# EAGLE design pqc-rev1 (EAGLE 6.1)
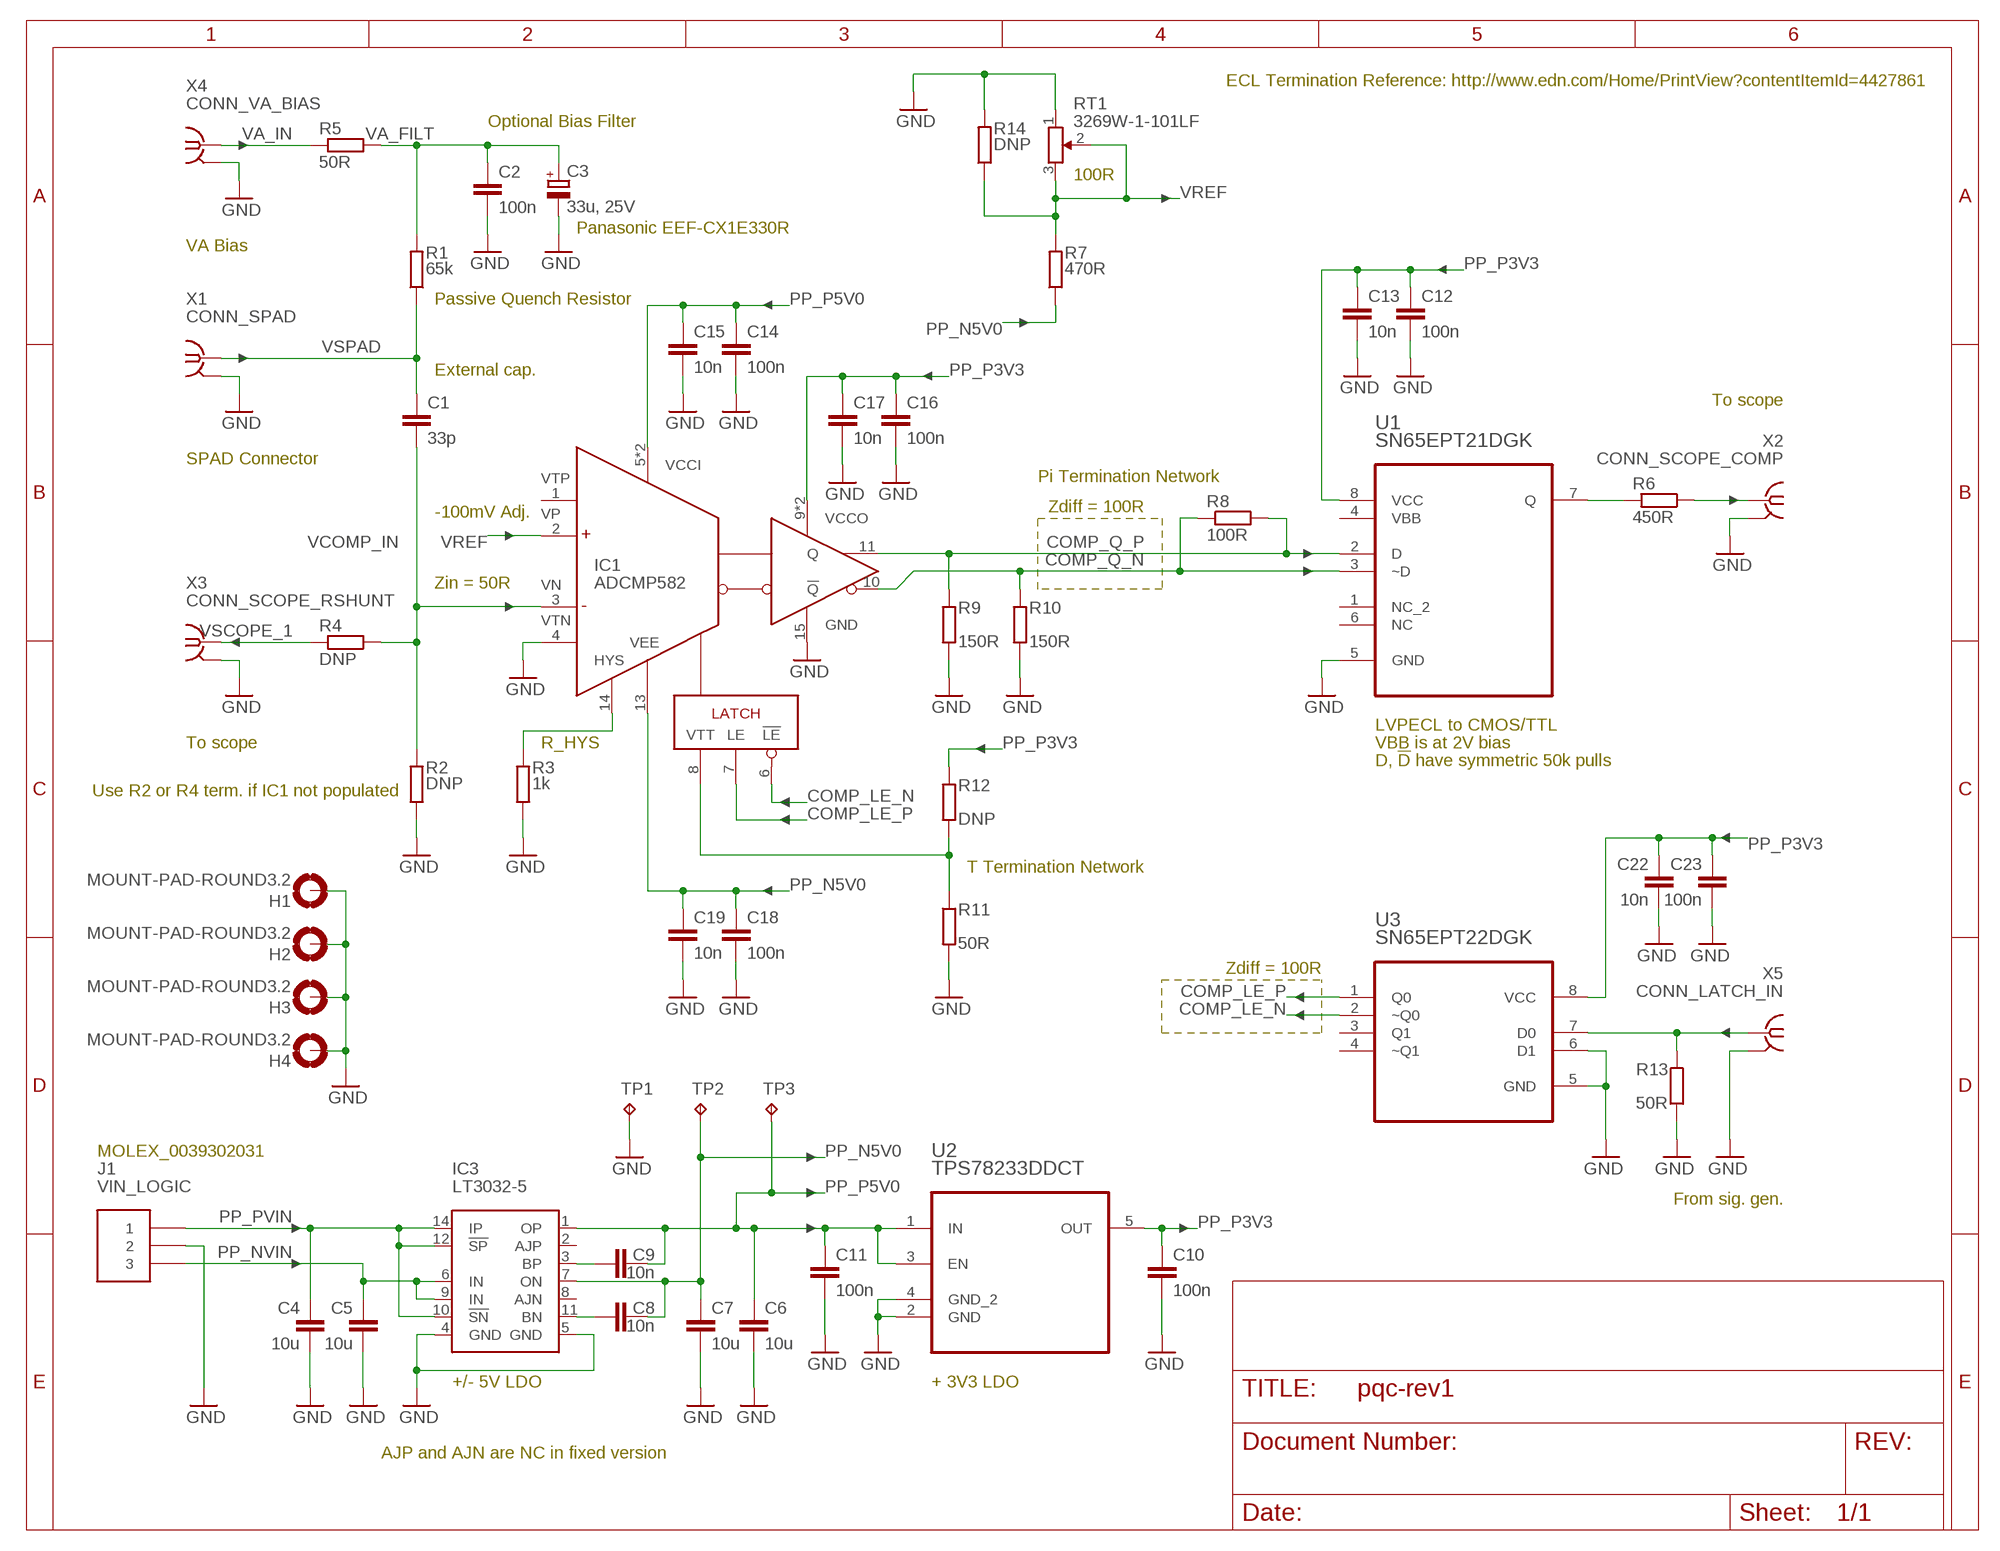
[diagram p0: schematic, sheet 1]

## Parts
C1  33p  C-EUC0805  [C0805]
C2  100n  C-EUC0805  [C0805]
C3  33u, 25V  CPOL-EUCT7343  [CT7343]
C4  10u  C-EUC1206  [C1206]
C5  10u  C-EUC1206  [C1206]
C6  10u  C-EUC1206  [C1206]
C7  10u  C-EUC1206  [C1206]
C8  10n  C-EUC0603  [C0603]
C9  10n  C-EUC0603  [C0603]
C10  100n  C-EUC0603  [C0603]
C11  100n  C-EUC0603  [C0603]
C12  100n  C-EUC0603  [C0603]
C13  10n  C-EUC0603  [C0603]
C14  100n  C-EUC0603  [C0603]
C15  10n  C-EUC0603  [C0603]
C16  100n  C-EUC0603  [C0603]
C17  10n  C-EUC0603  [C0603]
C18  100n  C-EUC0603  [C0603]
C19  10n  C-EUC0603  [C0603]
C22  10n  C-EUC0603  [C0603]
C23  100n  C-EUC0603  [C0603]
H1  MOUNT-PAD-ROUND3.2  [3,2-PAD]
H2  MOUNT-PAD-ROUND3.2  [3,2-PAD]
H3  MOUNT-PAD-ROUND3.2  [3,2-PAD]
H4  MOUNT-PAD-ROUND3.2  [3,2-PAD]
IC1  ADCMP582  [QFN50P300X300X80-16N]
IC3  LT3032-5  LT3032  [DFN14-4X3DE]
J1  VIN_LOGIC  CONN_MOLEX_3PIN_MINI-FIT_JR  [CONN_MOLEX_3PIN_MINI-FIT_JR]
R1  65k  R-EU_R0805  [R0805]
R2  DNP  R-EU_R0603  [R0603]
R3  1k  R-EU_R0805  [R0805]
R4  DNP  R-EU_R0603  [R0603]
R5  50R  R-EU_R0805  [R0805]
R6  450R  R-EU_R0805  [R0805]
R7  470R  R-EU_R0805  [R0805]
R8  100R  R-EU_R0603  [R0603]
R9  150R  R-EU_R0603  [R0603]
R10  150R  R-EU_R0603  [R0603]
R11  50R  R-EU_R0603  [R0603]
R12  DNP  R-EU_R0603  [R0603]
R13  50R  R-EU_R0603  [R0603]
R14  DNP  R-EU_R0805  [R0805]
RT1  3269W-1-101LF  BOURNS_3269WX  [3269W]
TP1  TPTP20R  [TP20R]
TP2  TPTP20R  [TP20R]
TP3  TPTP20R  [TP20R]
U1  SN65EPT21DGK  [SOP65P490X110-8N]
U2  TPS78233DDCT  [SOT95P280X110-5N]
U3  SN65EPT22DGK  [SOP65P490X110-8N]
X1  CONN_SPAD  SMA-142-0711-871/876  [J502-ND-142-0711-871/876]
X2  CONN_SCOPE_COMP  SMA-142-0711-871/876  [J502-ND-142-0711-871/876]
X3  CONN_SCOPE_RSHUNT  SMA-142-0711-871/876  [J502-ND-142-0711-871/876]
X4  CONN_VA_BIAS  SMA-142-0711-871/876  [J502-ND-142-0711-871/876]
X5  CONN_LATCH_IN  SMA-142-0711-871/876  [J502-ND-142-0711-871/876]

## Nets
COMP_LE_N [100OHM_DIFF]: IC1.6(!LE) U3.2(~Q0)
COMP_LE_P [100OHM_DIFF]: IC1.7(LE) U3.1(Q0)
COMP_Q_N [100OHM_DIFF]: IC1.10(!Q) R8.1 R10.1 U1.3(~D)
COMP_Q_P [100OHM_DIFF]: IC1.11(Q) R8.2 R9.1 U1.2(D)
GND: C2.2 C3.- C4.2 C5.2 C6.2 C7.2 C10.2 C11.2 C12.2 C13.2 C14.2 C15.2 C16.2 C17.2 C18.2 C19.2 C22.2 C23.2 H1.B3,2(MOUNT) H2.B3,2(MOUNT) H3.B3,2(MOUNT) H4.B3,2(MOUNT) IC1.4(VTN) IC1.15(GND) IC3.4(GND) IC3.5(GND) J1.2 R2.1 R3.1 R9.2 R10.2 R11.2 R13.2 R14.2 RT1.1 TP1.TP U1.5(GND) U2.2(GND) U2.4(GND_2) U3.5(GND) U3.6(D1) X1.G@1(GND) X2.G@1(GND) X3.G@1(GND) X4.G@1(GND) X5.G@1(GND)
N$1: R6.2 U1.7(Q)
N$2: R6.1 X2.1
N$4: IC1.14(HYS) R3.2
N$6: IC1.8(VTT) R11.1 R12.2
N$8: C9.1 IC3.3(BP)
N$9: C8.1 IC3.11(BN)
N$10: R13.1 U3.7(D0) X5.1
PP_N5V0: C7.1 C8.2 C18.1 C19.1 IC1.13(VEE) IC3.7(ON) R7.1 TP2.TP
PP_NVIN: C5.1 IC3.6(IN) IC3.9(IN) J1.3
PP_P3V3: C10.1 C12.1 C13.1 C16.1 C17.1 C22.1 C23.1 IC1.9(VCCO) IC1.12(VCCO) R12.1 U1.8(VCC) U2.5(OUT) U3.8(VCC)
PP_P5V0: C6.1 C9.2 C11.1 C14.1 C15.1 IC1.5(VCCI) IC1.16(VCCI) IC3.1(OP) TP3.TP U2.1(IN) U2.3(EN)
PP_PVIN: C4.1 IC3.10(!SN) IC3.12(!SP) IC3.14(IP) J1.1
VA_FILT: C2.1 C3.+ R1.2 R5.1
VA_IN: R5.2 X4.1
VCOMP_IN: C1.2 IC1.3(VN) R2.2 R4.1
VREF: IC1.2(VP) R7.2 R14.1 RT1.2 RT1.3
VSCOPE_1: R4.2 X3.1
VSPAD: C1.1 R1.1 X1.1
Unconnected: IC1.1(VTP) IC3.2(AJP) IC3.8(AJN) U1.1(NC_2) U1.6(NC) U3.3(Q1) U3.4(~Q1)

## Notes on the sheet
- ECL Termination Reference: http://www.edn.com/Home/PrintView?contentItemId=4427861
- Optional Bias Filter
- 100R
- Panasonic EEF-CX1E330R
- VA Bias
- Passive Quench Resistor
- External cap.
- To scope
- SPAD Connector
- Pi Termination Network
- Zdiff = 100R
- -100mV Adj.
- Zin = 50R
- LVPECL to CMOS/TTL
- To scope | R_HYS | VBB is at 2V bias
- D, !D! have symmetric 50k pulls
- Use R2 or R4 term. if IC1 not populated
- T Termination Network
- Zdiff = 100R
- MOLEX_0039302031
- From sig. gen.
- +/- 5V LDO | + 3V3 LDO
- AJP and AJN are NC in fixed version

## Power pins joined to a net without a drawn wire
GND: X1.G@2(GND) X1.G@3(GND) X1.G@4(GND) X2.G@2(GND) X2.G@3(GND) X2.G@4(GND) X3.G@2(GND) X3.G@3(GND) X3.G@4(GND) X4.G@2(GND) X4.G@3(GND) X4.G@4(GND) X5.G@2(GND) X5.G@3(GND) X5.G@4(GND)
VBB: U1.4(VBB)

## Library data of the parts
C1 C2 C4-C19 C22 C23 = rcl:C-EU: CAPACITOR, European symbol
C3 = rcl:CPOL-EU: POLARIZED CAPACITOR, European symbol
H1-H4 = holes:MOUNT-PAD-ROUND: MOUNTING PAD, round
IC1 = meng:ADCMP582: Ultrafast SiGe Voltage Comparator w/. PECL Outputs http://www.analog.com/media/en/technical-documentation/data-sheets/ADCMP580_581_582.pdf
IC3 = meng:LT3032: LT3032 dual postive/negative LDO linear regulator; VALUE: LT3032
J1 = Kramnik's Library:CONN_MOLEX_3PIN_MINI-FIT_JR; VALUE: MOLEX_0039302031
R1-R14 = rcl:R-EU_: RESISTOR, European symbol
RT1 = meng:BOURNS_3269WX
TP1-TP3 = testpad:TP: Test pad
U1 = Texas Instruments_By_element14_Batch_1:SN65EPT21DGK: 3.3-V Differential PECL/LVDS to TTL Translator; MPN: SN65EPT21DGK; OC_FARNELL: -; OC_NEWARK: 74R6512; PACKAGE: MSOP-8; SUPPLIER: Texas Instruments
U2 = Texas Instruments_By_element14_Batch_1 (2):TPS78233DDCT: Low-Dropout Linear Regulator; MPN: TPS78233DDCT; OC_FARNELL: 1710835; OC_NEWARK: 45P8307; PACKAGE: TSOT-23-5; SUPPLIER: Texas Instruments
U3 = Texas Instruments_By_element14_Batch_1:SN65EPT22DGK: Dual LVTTL/LVCMOS to Differential LVPECL Buffer; MPN: SN65EPT22DGK; OC_FARNELL: -; OC_NEWARK: 45P8158; PACKAGE: MSOP-8; SUPPLIER: Texas Instruments
X1-X5 = con-coax:SMA-: SMA 50 Ohm End Launch Jack Receptacle - Round Contact Johnson Components Source: www.johnsoncomponents.com .. J502-ND.pdf; MF: JOHNSON COMPONENTS; MPN: 142-0711-871; OC_FARNELL: unknown; OC_NEWARK: 01C1639

## Net classes
1 100OHM_DIFF: width 0.254 mm, clearance 0.254 mm

## Board
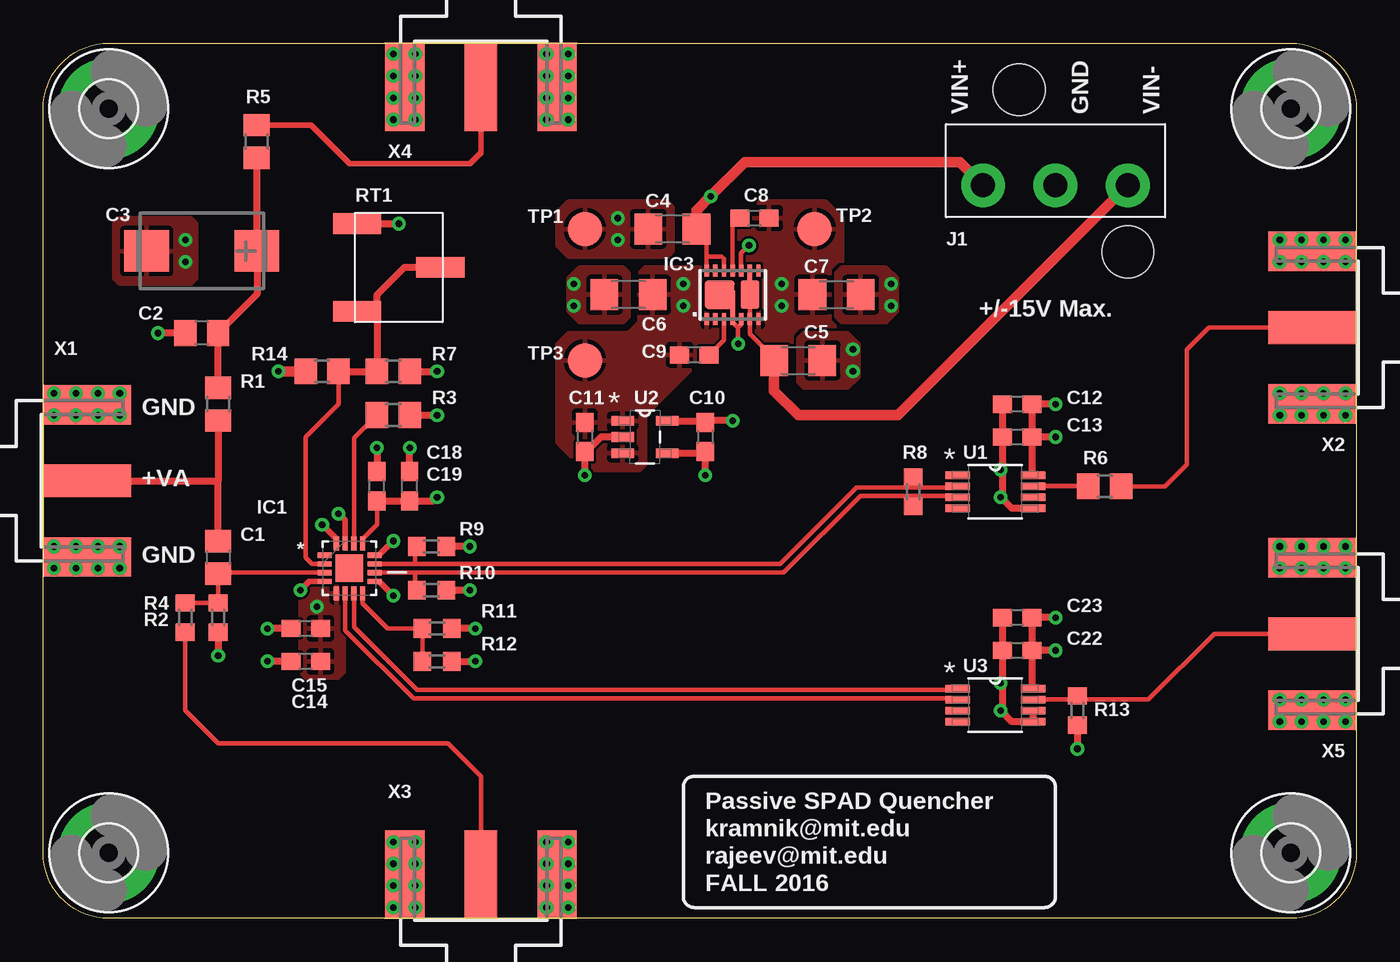
[diagram p1: board, top side]
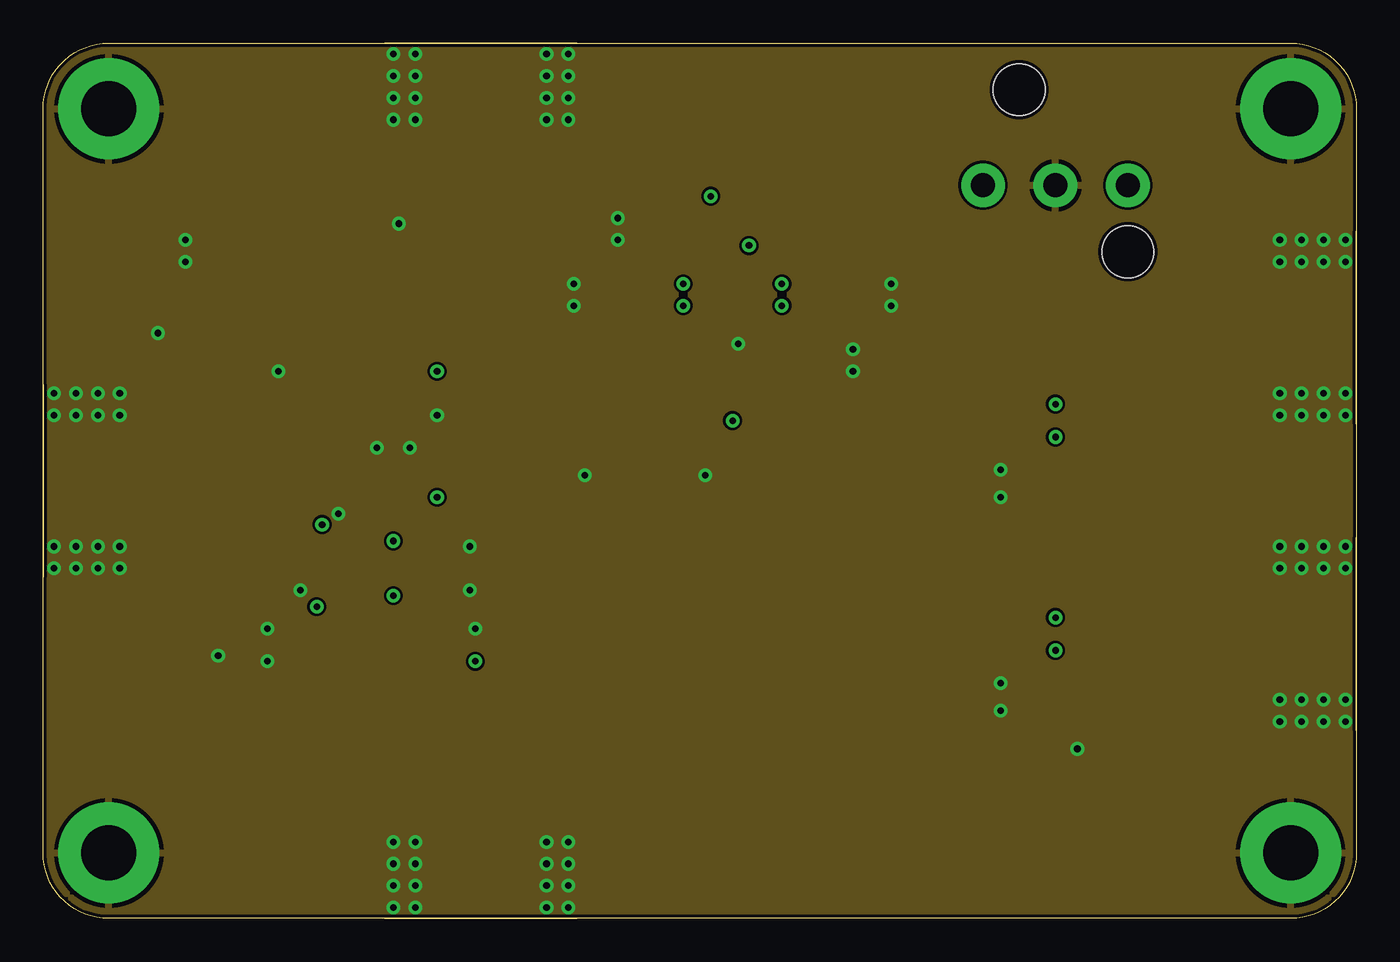
[diagram p2: board, inner layer Route2]
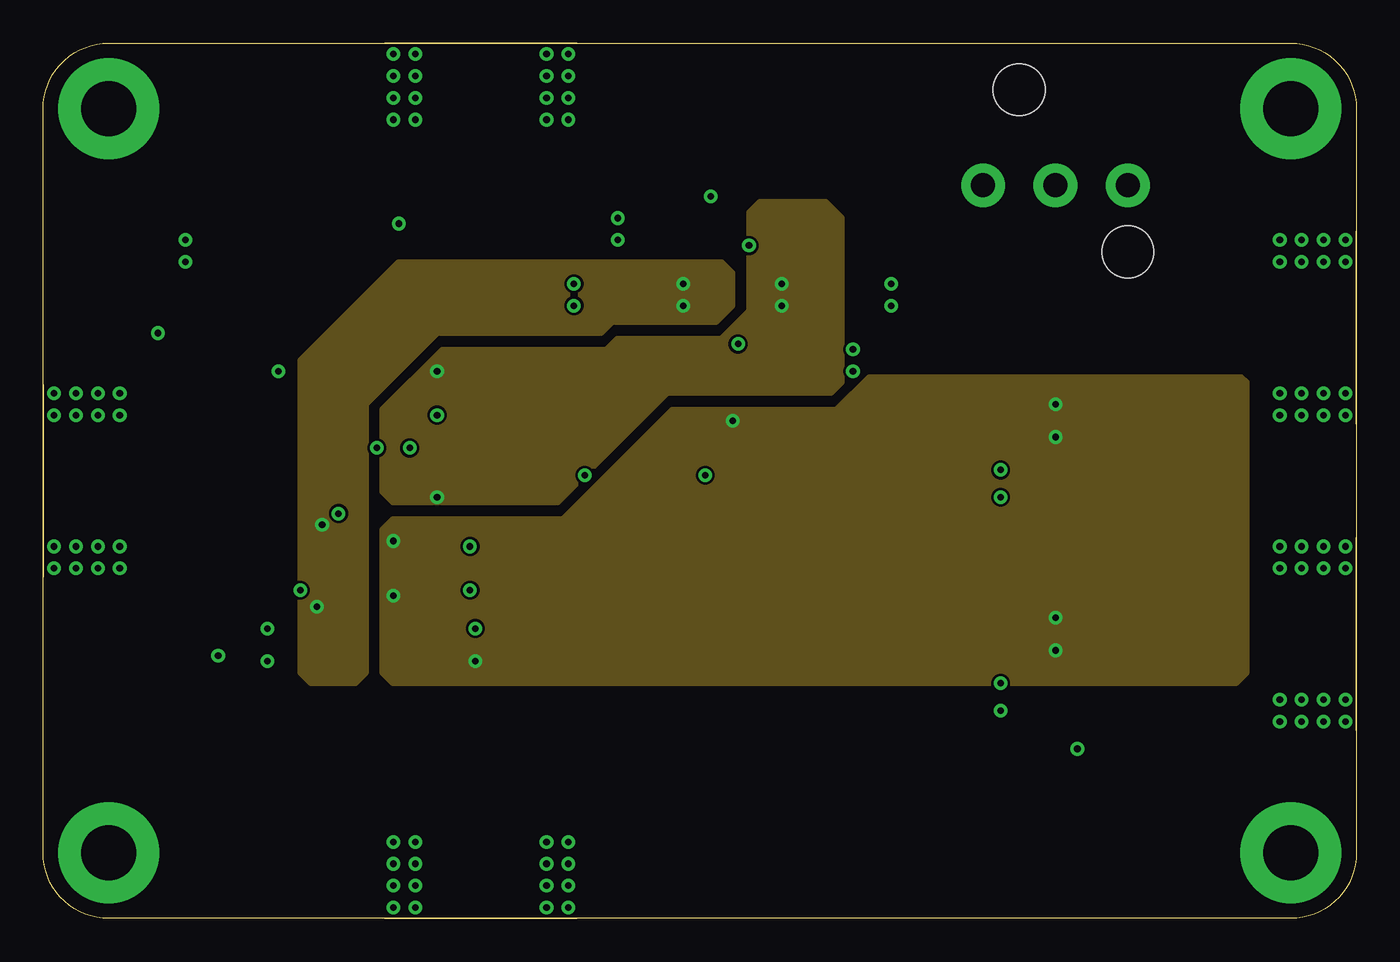
[diagram p3: board, inner layer Route15]
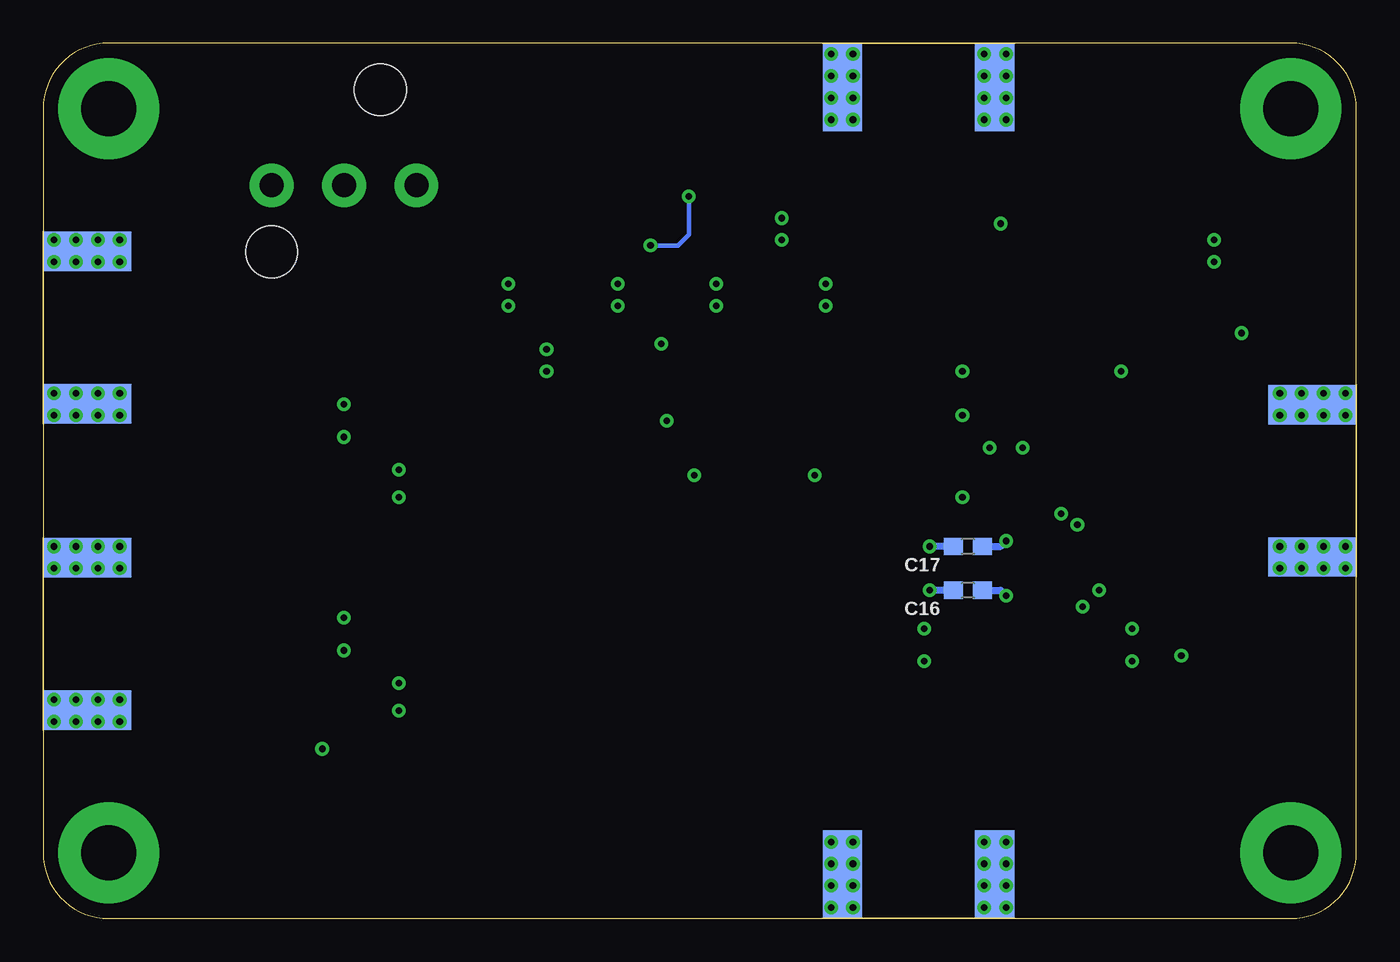
[diagram p4: board, bottom side, seen from below]

Size 76.2 x 50.8 mm. Coordinates in mm from the lower left corner, seen from the top.
Outline: 76.2,46.99 76.2,3.81 arc-90 72.39,0 3.81,0 arc-90 0,3.81 0,46.99 arc-90 3.81,50.8 72.39,50.8 arc-90 76.2,46.99
Copper layers (1+2*15+16): Top 0.035mm / dielectric 1.5mm / Route2 0.035mm / dielectric 0.15mm / Route15 0.035mm / dielectric 0.2mm / Bottom 0.035mm
Design rules: minimum track width 10mil, minimum drill 15mil, track to track 6mil, track to pad 6mil, pad to pad 6mil, via to via 6mil, smd to smd 6mil, copper to edge 8mil, drill to drill 8mil, minimum pad ring 10mil, minimum via ring 8mil, stop-mask expansion 4mil, vias tented up to drill 0mil, thermal gap 10mil

### Footprints (pad centres in the part's own frame; a part is rotated, then mirrored left to right if it is on the bottom)
C0805 = smd 1.3 x 1.5: 1 -0.95,0; 2 0.95,0
CT7343 = smd 2.6 x 2.4: + -3.2,0; - 3.2,0
C1206 = smd 1.6 x 1.8: 1 -1.4,0; 2 1.4,0
C0603 = smd 1.1 x 1: 1 -0.85,0; 2 0.85,0
3,2-PAD = drill 3.2 pad 5.842: B3,2 0,0
QFN50P300X300X80-16N = smd 0.813 x 0.305: 1 -1.448,0.762; 2 -1.448,0.254; 3 -1.448,-0.254; 4 -1.448,-0.762; 9 1.448,-0.762; 10 1.448,-0.254; 11 1.448,0.254; 12 1.448,0.762 | smd 0.305 x 0.813: 5 -0.762,-1.448; 6 -0.254,-1.448; 7 0.254,-1.448; 8 0.762,-1.448; 13 0.762,1.448; 14 0.254,1.448; 15 -0.254,1.448; 16 -0.762,1.448 | smd 1.6 x 1.6: 17 0,0
DFN14-4X3DE = smd 0.25 x 0.7: 1 -1.5,-1.4; 2 -1,-1.4; 3 -0.5,-1.4; 5 0.5,-1.4; 6 1,-1.4; 7 1.5,-1.4; 8 1.5,1.4; 10 0.5,1.4; 11 0,1.4; 12 -0.5,1.4; 13 -1,1.4; 14 -1.5,1.4 | smd 0.25 x 2: 4 0,-0.75; 9 1,0.75 | smd 1.75 x 1.65: 4@1 -0.75,0 | smd 1.07 x 1.65: 9@2 1,0
CONN_MOLEX_3PIN_MINI-FIT_JR = drill 1.4 pad 2.54: 1 4.2,0; 2 0,0; 3 -4.2,0 | hole 3: 2.1,-5.55; -4.2,3.85
R0805 = smd 1.3 x 1.5: 1 -0.95,0; 2 0.95,0
R0603 = smd 1 x 1.1: 1 -0.85,0; 2 0.85,0
3269W = smd 1.194 x 2.794: 1 -2.54,-2.413; 2 0,2.413; 3 2.54,-2.413
TP20R = smd 2 x 2: TP 0,0
SOP65P490X110-8N = smd 1.422 x 0.432: 1 -2.184,0.965; 2 -2.184,0.33; 3 -2.184,-0.33; 4 -2.184,-0.965; 5 2.184,-0.965; 6 2.184,-0.33; 7 2.184,0.33; 8 2.184,0.965
SOT95P280X110-5N = smd 1.321 x 0.559: 1 -1.295,0.94; 2 -1.295,0; 3 -1.295,-0.94; 4 1.295,-0.94; 5 1.295,0.94
J502-ND-142-0711-871/876 = smd 5.08 x 1.905: 1 2.565,0 | smd 5.08 x 2.286: G@1 2.565,4.42; G@2 2.565,-4.42 | smd 5.08 x 2.286 bottom: G@3 2.565,4.42; G@4 2.565,-4.42

### Placement (x,y rotation side)
C1  10.16,20.95 270 top
C2  9.21,33.97 180 top
C3  9.21,38.73 180 top
C4  36.51,40.01 180 top
C5  43.81,32.38 0 top
C6  33.97,36.2 180 top
C7  46.04,36.2 0 top
C8  41.27,40.64 0 top
C9  37.78,32.7 180 top
C10  38.42,27.94 270 top
C11  31.43,27.94 270 top
C12  56.52,29.84 180 top
C13  56.52,27.94 180 top
C14  15.24,14.92 180 top
C15  15.24,16.83 180 top
C16  22.54,19.05 180 bottom
C17  22.54,21.59 180 bottom
C18  21.27,25.08 90 top
C19  19.37,25.08 90 top
C22  56.52,15.56 180 top
C23  56.52,17.46 180 top
H1  3.81,3.81 0 top
H2  72.39,3.81 0 top
H3  72.39,46.99 0 top
H4  3.81,46.99 0 top
IC1  17.78,20.32 0 top
IC3  40.01,36.2 0 top
J1  58.74,42.55 180 top
R1  10.16,29.84 90 top
R2  10.16,17.46 90 top
R3  20.32,29.21 180 top
R4  8.26,17.46 270 top
R5  12.38,45.09 90 top
R6  61.59,25.08 180 top
R7  20.32,31.75 180 top
R8  50.48,24.77 90 top
R9  22.54,21.59 0 top
R10  22.54,19.05 0 top
R11  22.86,16.83 0 top
R12  22.86,14.92 180 top
R13  60.01,12.06 270 top
R14  16.19,31.75 180 top
RT1  20.64,37.78 270 top
TP1  31.43,40.01 0 top
TP2  44.77,40.01 0 top
TP3  31.43,32.38 0 top
U1  55.24,24.77 0 top
U2  34.92,27.94 0 top
U3  55.24,12.38 0 top
X1  0,25.4 0 top
X2  76.2,34.29 180 top
X3  25.4,0 90 top
X4  25.4,50.8 270 top
X5  76.2,16.51 180 top

### Tracks (layer width: path | path; a pad name or v marks a point on that pad's centre or on a via)
COMP_LE_N
  Top 0.254: U3.2 52.44,12.71 52.39,12.76 21.48,12.76 17.53,16.72 IC1.6
COMP_LE_P
  Top 0.254: U3.1 52.46,13.35 52.39,13.27 21.7,13.27 18.03,16.93 IC1.7
COMP_Q_N
  Top 0.254: U1.3 52.46,24.43 52.39,24.51 50.48,24.51 | 50.48,24.51 47.41,24.51 42.97,20.07 21.59,20.07 | 21.59,20.07 IC1.10 | R10.1 21.59,19.05 21.59,20.07 | R8.1 50.48,24.51
COMP_Q_P
  Top 0.254: U1.2 52.46,25.09 52.39,25.02 50.48,25.02 | 50.48,25.02 47.2,25.02 42.76,20.57 21.59,20.57 | 21.59,20.57 IC1.11 | R9.1 21.59,21.59 21.59,20.57 | R8.2 50.48,25.02
GND  (via drill 0.38)
  Top 0.254: IC3.5 40.51,34.47 40.32,34.29 | IC3.4 40.01,34.61 40.32,34.29 | 40.32,34.29 v40.32,33.34
  Top 0.305: IC1.15 17.53,23.11 v17.14,23.5 | IC1.4 15.43,19.56 v14.92,19.05
  Top 0.406: U3.6 U3.5 56.21,11.42 v55.56,12.06 55.66,12.17 C22.2 C23.2 | R13.2 v60.01,9.84 | C12.2 C13.2 55.66,24.55 v55.56,24.45 56.21,23.8 U1.5 | C2.2 v6.67,33.97 | R2.1 v10.16,15.24 | U2.2 32.38,27.94 31.54,27.09 C11.2 v31.43,25.72 | C10.2 38.42,27.3 | C10.2 v38.42,25.72 | U2.4 38.33,27 C10.2 | R3.1 v22.86,29.21 | v24.77,19.05 C16.2 | v24.77,21.59 C17.2 | v25.08,16.83 R11.2 | X1.G@1 v1.91,30.48 | X1.G@4 v3.17,21.59 | X2.G@4 73.64,38.76 v73.03,39.37 | X4.G@4 20.93,48.23 v20.32,47.62 | X4.G@1 v29.21,47.62 | RT1.1 v20.64,40.32 | v19.37,27.3 C19.2 | C18.2 v21.27,27.3 | C15.2 v13.02,16.83 | C14.2 v13.02,14.92
  Top 0.61: X5.G@4 73.64,20.98 v73.03,21.59 | X5.G@1 v73.03,12.7 | X2.G@1 v73.03,30.48 | X3.G@1 v21.59,3.17 | X3.G@4 29.87,2.56 v30.48,3.17 | R14.2 v13.65,31.75
  Bottom 0.406: X1.G@1 v1.91,30.48 | X1.G@4 v3.17,21.59 | X2.G@4 73.64,38.76 v73.03,39.37 | X4.G@4 20.61,47.92 v20.32,47.62 | X4.G@1 v29.21,47.62 | C16.2 v24.77,19.05 | C17.2 v24.77,21.59
  Bottom 0.61: X5.G@4 73.64,20.98 v73.03,21.59 | X5.G@1 v73.03,12.7 | X2.G@1 v73.03,30.48 | X3.G@1 v21.59,3.17 | X3.G@4 29.87,2.56 v30.48,3.17
  other vias: 55.56,13.65 55.56,26.04 8.26,39.37 8.26,38.1 46.99,33.02 46.99,31.75 33.34,40.64 33.34,39.37 49.21,36.83 49.21,35.56 30.8,36.83 30.8,35.56 0.64,30.48 0.64,29.21 1.91,29.21 3.17,30.48 4.45,30.48 3.17,29.21 4.45,29.21 0.64,21.59 0.64,20.32 1.91,21.59 1.91,20.32 4.45,21.59 4.45,20.32 3.17,20.32 21.59,46.35 21.59,47.62 21.59,48.9 21.59,50.16 20.32,50.16 20.32,48.9 20.32,46.35 29.21,46.35 30.48,46.35 30.48,47.62 29.21,48.9 30.48,48.9 30.48,50.16 29.21,50.16 71.75,39.37 71.75,38.1 73.03,38.1 74.3,39.37 74.3,38.1 75.56,38.1 75.56,39.37 74.3,30.48 75.56,30.48 71.75,30.48 71.75,29.21 73.03,29.21 74.3,29.21 75.56,29.21 75.56,21.59 74.3,21.59 71.75,21.59 71.75,20.32 73.03,20.32 74.3,20.32 75.56,20.32 75.56,12.7 74.3,12.7 71.75,12.7 71.75,11.43 73.03,11.43 74.3,11.43 75.56,11.43 30.48,0.64 30.48,1.91 30.48,4.45 29.21,4.45 29.21,3.17 29.21,1.91 29.21,0.64 21.59,0.64 21.59,1.91 21.59,4.45 20.32,4.45 20.32,3.17 20.32,1.91 20.32,0.64
  pour Route2: 0,0 76.2,0 76.2,50.8 0,50.8
  pour Top: 4.45,40.64 8.57,40.64 8.89,40.32 8.89,37.15 8.57,36.83 4.45,36.83 4.13,37.15 4.13,40.32
  pour Top: 30.48,41.59 29.84,40.96 29.84,39.05 30.48,38.42 36.2,38.42 36.51,38.73 36.51,41.27 36.2,41.59
  pour Top: 44.13,33.97 43.81,33.66 43.81,31.11 44.13,30.8 46.67,30.8 47.31,31.43 47.31,33.34 46.67,33.97
  pour Top: 31.11,37.78 30.48,37.15 30.48,35.24 31.11,34.61 33.66,34.61 33.97,34.92 33.97,37.47 33.66,37.78
  pour Top: 48.9,34.61 49.53,35.24 49.53,37.15 48.9,37.78 46.35,37.78 46.04,37.47 46.04,34.92 46.35,34.61
N$1
  Top 0.254: U1.7 60.63,25.09 R6.2
N$2
  Top 0.254: R6.1 65.09,25.08 66.36,26.35 66.36,33.02 67.63,34.29 X2.1
N$4
  Top 0.254: IC1.14 18.03,27.87 R3.2
N$6
  Top 0.254: R12.2 R11.1 20,16.83 18.54,18.29 IC1.8
N$8
  Top 0.254: IC3.3 39.51,33.58 C9.1
N$9
  Top 0.254: IC3.11 40.01,40.22 C8.1
N$10
  Top 0.254: U3.7 60.01,12.71 | 60.01,12.71 64.14,12.7 67.96,16.52 73.62,16.52 X5.1 | R13.1 60.01,12.71
PP_N5V0  (via drill 0.38)
  Top 0.254: IC1.13 18.54,22.04 19.37,22.86 C19.1
  Top 0.406: C19.1 C18.1 22.64,24.23 v22.86,24.45 | R7.1 v22.86,31.75
  other vias: 42.86,36.83 42.86,35.56
  pour Top (rank 6): 41.59,41.59 40.32,40.32 40.32,38.73 40.64,34.29 41.91,33.02 45.72,33.02 46.35,33.66 46.35,40.64 45.4,41.59
  pour Route15: 20.32,24.13 29.84,24.13 36.2,30.48 45.72,30.48 46.35,31.11 46.35,40.64 45.4,41.59 41.59,41.59 40.96,40.96 40.96,35.24 39.37,33.66 33.34,33.66 32.7,33.02 23.18,33.02 19.68,29.53 19.68,24.77
PP_NVIN
  Top 0.254: IC3.9 IC3.6 41.01,33.92 42.41,32.52 C5.1
  Top 0.61: C5.1 42.41,30.61 43.81,29.21 49.6,29.21 J1.3
PP_P3V3  (via drill 0.38)
  Top 0.305: IC1.12 19.49,21.08 v20.32,21.91 | IC1.9 19.49,19.56 v20.32,18.73
  Top 0.406: C13.1 57.37,25.8 U1.8 | C12.1 C13.1 | C23.1 C22.1 | C22.1 57.37,13.41 U3.8 | U2.5 38.33,28.88 C10.1 38.52,28.89 v40.01,28.89 | v58.74,27.94 C13.1 | v58.74,29.84 57.47,29.84 | v58.74,15.56 C22.1 | v58.74,17.46 57.47,17.46 | R12.1 v25.08,14.92
  Bottom 0.406: C17.1 20.64,21.59 v20.32,21.91 | C16.1 20.64,19.05 v20.32,18.73
  pour Route15: 19.68,22.54 19.68,14.29 20.32,13.65 69.22,13.65 69.85,14.29 69.85,31.11 69.53,31.43 47.94,31.43 46.04,29.53 36.51,29.53 30.16,23.18 20.32,23.18
PP_P5V0  (via drill 0.38)
  Top 0.305: IC1.16 17.02,22.04 v16.19,22.86
  other vias: 15.88,18.1 37.15,36.83 37.15,35.56
  pour Top (rank 6): 34.92,29.21 39.37,33.66 39.37,37.47 39.05,37.78 34.92,37.78 34.61,37.47 34.61,34.61 33.97,33.97 30.48,33.97 29.84,33.34 29.84,27.62 31.43,26.04 34.61,26.04 34.92,26.35
  pour Route15: 18.73,14.29 18.73,29.84 22.86,33.97 32.38,33.97 33.02,34.61 39.05,34.61 40.01,35.56 40.01,37.47 39.37,38.1 20.64,38.1 14.92,32.38 14.92,14.29 15.56,13.65 18.1,13.65
  pour Top: 17.46,19.68 17.46,14.29 17.14,13.97 15.24,13.97 14.92,14.29 14.92,18.73 15.88,19.68
PP_PVIN  (via drill 0.38)
  Top 0.254: IC3.14 38.51,38.42 | 38.51,38.42 38.51,39.41 C4.1 | IC3.12 39.51,38.28 39.37,38.42 38.51,38.42 | IC3.10 40.51,38.6 v40.96,39.05
  Top 0.61: C4.1 37.91,41.09 v38.73,41.91 40.71,43.89 53.2,43.89 J1.1
  Bottom 0.254: v38.73,41.91 38.73,39.69 39.37,39.05 v40.96,39.05
VA_FILT
  Top 0.406: R5.1 12.41,43.84 C3.+ 12.41,36.22 C2.1 R1.2
VA_IN
  Top 0.305: X4.1 25.4,44.45 24.77,43.81 17.78,43.81 15.56,46.03 R5.2
VCOMP_IN
  Top 0.254: IC1.3 10.22,20.07 C1.2 R2.2 R4.1
VREF
  Top 0.254: IC1.2 15.62,20.57 15.24,20.95 15.24,27.94 17.14,29.84 R14.1
  Top 0.406: R14.1 R7.2 19.37,35.24 | RT1.3 19.37,35.24 | 19.37,35.24 19.37,36.2 20.95,37.78 RT1.2
VSCOPE_1
  Top 0.254: X3.1 25.4,8.26 23.5,10.16 10.16,10.16 8.26,12.06 R4.2
VSPAD
  Top 0.406: R1.1 10.16,25.4 | C1.1 10.16,25.4 | X1.1 10.16,25.4

### Text on the board
tPlace: VIN+ | GND | VIN- | +/-15V Max. | GND | +VA | GND | Passive SPAD Quencher | kramnik@mit.edu | rajeev@mit.edu | FALL 2016